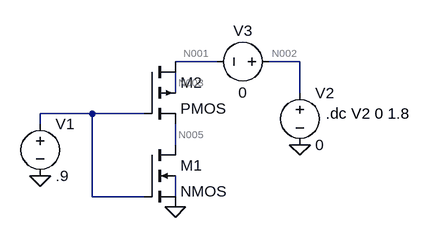
[diagram p0: schematic tut2 Q6 b.asc]
tut2 Q6 b.asc, the LTspice schematic file:
Version 4
SHEET 1 1520 680
WIRE 288 32 224 32
WIRE 416 32 368 32
WIRE 224 80 224 48
WIRE 416 80 416 32
WIRE 96 112 16 112
WIRE 176 112 96 112
WIRE 16 128 16 112
WIRE 224 160 224 128
WIRE 96 240 96 112
WIRE 176 240 96 240
WIRE 224 240 224 208
FLAG 16 208 0
FLAG 224 256 0
FLAG 416 160 0
SYMBOL voltage 16 112 R0
WINDOW 123 0 0 Left 2
WINDOW 39 0 0 Left 2
SYMATTR InstName V1
SYMATTR Value .9
SYMBOL voltage 416 64 R0
WINDOW 123 0 0 Left 2
WINDOW 39 0 0 Left 2
SYMATTR InstName V2
SYMATTR Value 0
SYMBOL nmos4 176 160 R0
SYMATTR InstName M1
SYMATTR Value2 l=.36 w=5
SYMBOL pmos4 176 32 R0
SYMATTR InstName M2
SYMATTR Value2 l=.36 w=5
SYMBOL voltage 384 32 R90
WINDOW 0 -32 56 VBottom 2
WINDOW 3 32 56 VTop 2
WINDOW 123 0 0 Left 2
WINDOW 39 0 0 Left 2
SYMATTR InstName V3
SYMATTR Value 0
TEXT 456 112 Left 2 !.dc V2 0 1.8

The netlist it stands for:
* tut2 Q6 b.asc
V1 N004 0 .9
V2 N002 0 0
M1 N005 N004 0 N006 NMOS l=.36 w=5
M2 N001 N004 N005 N003 PMOS l=.36 w=5
V3 N002 N001 0
.model NMOS NMOS
.model PMOS PMOS
.lib standard.mos
.dc V2 0 1.8
.backanno
.end

* Results of the author's LTspice run, read from the files saved beside the schematic
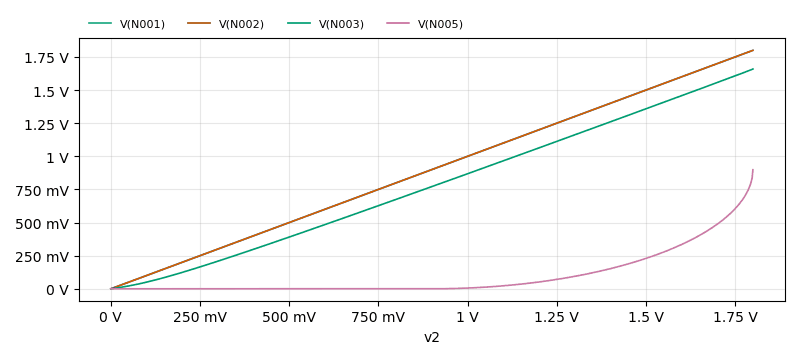
[diagram p1: DC transfer characteristic of tut2 Q6 b.asc, plotted from the saved traces]
* DC transfer characteristic, 1 run:
*   V(N001): 0 V at v2=0 V, 1.8 V at v2=1.8 V, min 0 V, max 1.8 V
*   V(N002): 0 V at v2=0 V, 1.8 V at v2=1.8 V, min 0 V, max 1.8 V
*   V(N003): -0.1143 fV at v2=0 V, 1.659 V at v2=1.8 V, min -0.1143 fV, max 1.659 V
*   V(N005): 2.287e-10 fV at v2=0 V, 898.9 mV at v2=1.8 V, min 2.287e-10 fV, max 898.9 mV